# EAGLE design dashbutton_v1 (EAGLE 9.3.0)
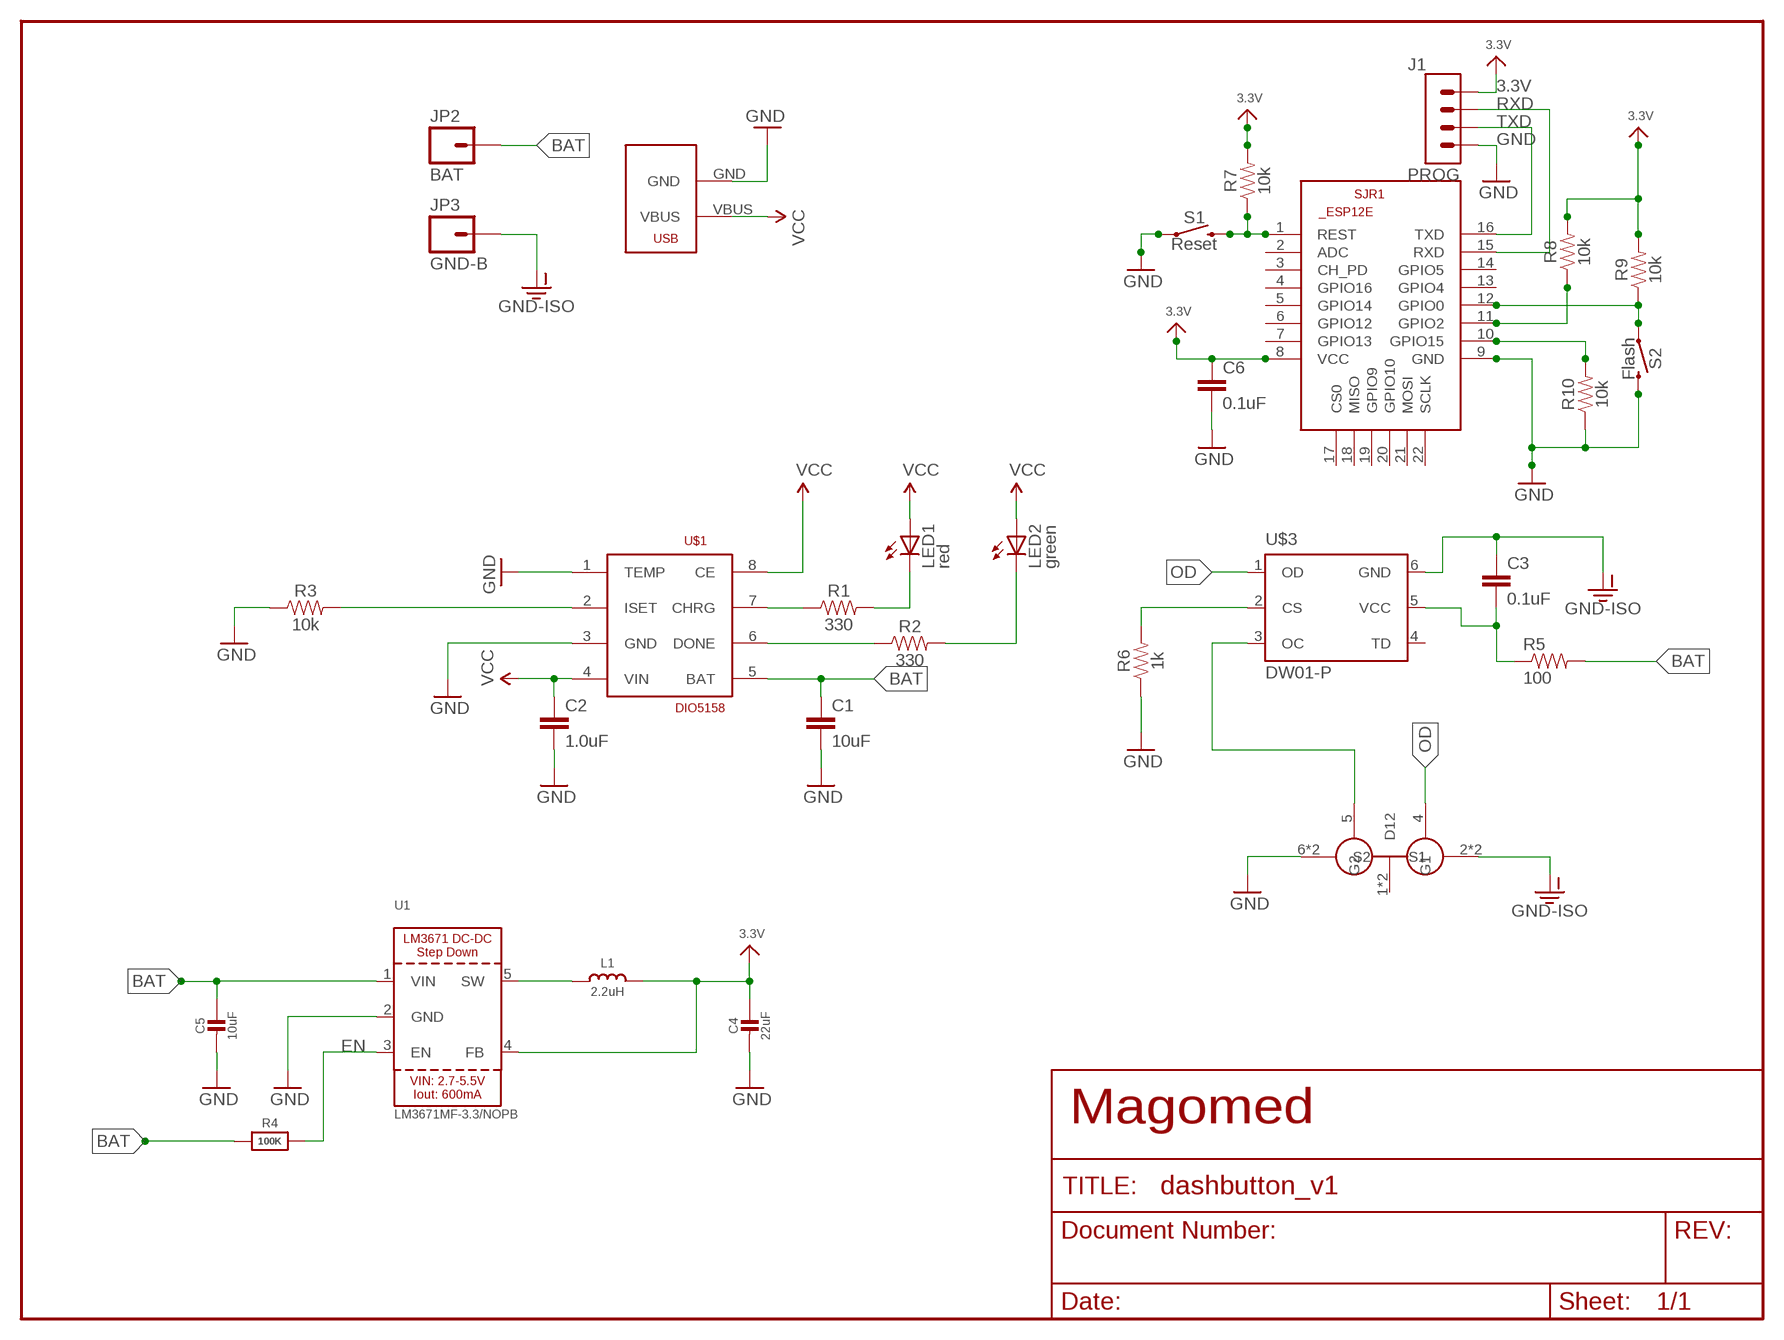
[diagram p0: schematic, sheet 1]

## Parts
C1  10uF  10UF-1206-6.3V-20%  [1206]
C2  1.0uF  1.0UF-0603-16V-10%  [0603]
C3  0.1uF  0.1UF-0603-25V-5%  [0603]
C4  22uF  CAP_CERAMIC0805-NOOUTLINE  [0805-NO]
C5  10uF  CAP_CERAMIC0805-NOOUTLINE  [0805-NO]
C6  0.1uF  0.1UF-0603-25V-5%  [0603]
J1  PROG  62000411121  [62000411121]
JP2  BAT  M01PTH  [1X01]
JP3  GND-B  M01PTH  [1X01]
L1  2.2uH  INDUCTORNRH2412T  [INDUCTOR_TAIYOYUDEN_NRH2412T]
LED1  red  LEDCHIP-LED0805  [CHIP-LED0805]
LED2  green  LEDCHIP-LED0805  [CHIP-LED0805]
R1  330  330OHM-0603-1/10W-1%  [0603]
R2  330  330OHM-0603-1/10W-1%  [0603]
R3  10k  2.49KOHM-0603-1/10W-1%  [0603]
R4  100K  RESISTOR0805_NOOUTLINE  [0805-NO]
R5  100  RESISTOR0603-RES  [0603-RES]
R6  1k  1KOHM-0603-1/10W-1%  [0603]
R7  10k  10KOHM-0603-1/10W-1%  [0603]
R8  10k  10KOHM-0603-1/10W-1%  [0603]
R9  10k  10KOHM-0603-1/10W-1%  [0603]
R10  10k  10KOHM-0603-1/10W-1%  [0603]
S1  Reset  MOMENTARY-SWITCH-SPST-SMD-6.2MM-TALL  [TACTILE_SWITCH_SMD_6.2MM_TALL]
S2  Flash  MOMENTARY-SWITCH-SPST-SMD-6.2MM-TALL  [TACTILE_SWITCH_SMD_6.2MM_TALL]
SJR1  ESP8266-12EESP12E  [ESP8266-ESP12E]
U1  LM3671MF-3.3/NOPB  VREG_LM3671  [SOT23-5]
U$1  DIO5158  [SOIC-8]
U$3  DW01-P  [SOT23-6L]
U$4  FS8205A  [TSSOP8]
U$5  USB-MICROB-POWERONLY  [USB-MICROB-POWERONLY]

## Nets
3.3V: C4.1 C6.1 J1.1 L1.2 R7.2 R8.2 R9.2 SJR1.8(VCC) U1.4(FB)
BAT: C1.1 C5.1 JP2.1 R4.1 R5.2 U1.1(VIN) U$1.5(BAT)
CHRG: R1.1 U$1.7(CHRG)
DONE: R2.1 U$1.6(DONE)
EN: R4.2 U1.3(EN)
GND: C1.2 C2.2 C4.2 C5.2 C6.2 J1.4 R3.1 R6.1 R10.1 S1.A2 S2.B2 SJR1.9(GND) U1.2(GND) U$1.1(TEMP) U$1.3(GND) U$4.6(S2) U$4.7(S2) U$5.GND
GND-ISO: C3.1 JP3.1 U$3.6(GND) U$4.2(S1) U$4.3(S1)
ISET: R3.2 U$1.2(ISET)
LED1: LED1.C R1.2
LED2: LED2.C R2.2
N$1: R6.2 U$3.2(CS)
N$2: U$3.3(OC) U$4.5(G2)
N$3: L1.1 U1.5(SW)
N$4: R7.1 S1.B2 SJR1.1(REST)
N$5: R9.1 S2.A2 SJR1.12(GPIO0)
N$6: R10.2 SJR1.10(GPIO15)
N$7: R8.1 SJR1.11(GPIO2)
OD: U$3.1(OD) U$4.4(G1)
RXD: J1.2 SJR1.15(RXD)
TXD: J1.3 SJR1.16(TXD)
VCC: C2.1 LED1.A LED2.A U$1.4(VIN) U$1.8(CE) U$5.VBUS
VCC-DW: C3.2 R5.1 U$3.5(VCC)
Unconnected: SJR1.2(ADC) SJR1.3(CH_PD) SJR1.4(GPIO16) SJR1.5(GPIO14) SJR1.6(GPIO12) SJR1.7(GPIO13) SJR1.13(GPIO4) SJR1.14(GPIO5) SJR1.17(CS0) SJR1.18(MISO) SJR1.19(GPIO9) SJR1.20(GPIO10) SJR1.21(MOSI) SJR1.22(SCLK) U$3.4(TD) U$4.1(D12) U$4.8(D12)

## Notes on the sheet
- Magomed

## Library data of the parts
C1 = SparkFun-Capacitors:10UF: 10.0µF ceramic capacitors A capacitor is a passive two-terminal electrical component used to store electrical energy temporarily in an electric field.; PROD_ID: CAP-10057
C2 = SparkFun-Capacitors:1.0UF: 1µF ceramic capacitors A capacitor is a passive two-terminal electrical component used to store electrical energy temporarily in an electric field.; PROD_ID: CAP-00868
C3 C6 = SparkFun-Capacitors:0.1UF: 0.1µF ceramic capacitors A capacitor is a passive two-terminal electrical component used to store electrical energy temporarily in an electric field.; PROD_ID: CAP-08604
C4 C5 = microbuilder:CAP_CERAMIC: Ceramic Capacitors For new designs, use the packages preceded by an '_' character since they are more reliable: The following footprints should be used on most boards: _0402 - Standard footprint for regular board layouts _0603 - Standard footprint for regular board layouts _0805 - Standard footprint for regular board layouts _1206 - Standard footprint for regular board layouts For extremely tight-pitch boards where space is at a premium, the following 'micro-pitch' footprints can be used (smaller pads, no silkscreen outline, etc.): _0402MP - Micro-pitch footprint for very dense/compact boards _0603MP - Micro-pitch footprint for very dense/compact boards _0805MP - Micro-pitch footprint for very dense/compact boards _1206MP - Micro-pitch footprint for very dense/compact boards
J1 = Headers:62000411121: THT Vertical Pin Header WR-PHD, Pitch 2.00 mm, Single Row, 4 pins Manufacturer's datasheet <https://datasheet.octopart.com/62000411121-W%C3%BCrth-Elektronik-datasheet-117282003.pdf>; CREATED_BY: PCBLayout.com; MANUFACTURER: Würth Elektronik; MPN: 62000411121
JP2 JP3 = SparkFun:M01: Header 1 Standard 1-pin 0.1" header. Use with straight break away headers (SKU : PRT-00116), right angle break away headers (PRT-00553), swiss pins (PRT-00743), machine pins (PRT-00117), and female headers (PRT-00115).
L1 = microbuilder:INDUCTOR: Inductors 0603: 10nH Ceramic Inductor - microwire antenna/RF (Digikey: 712-1434-2-ND) 0805: 560nH Ceramic Inductor - RF (Digikey: 553-1047-1-ND) 270nH Ceramic Inductor - Q = 40@250MHz, +-5%, 1 Ohm DC Resistance (Digikey: 535-10506-2-ND) 1007 (2518 Metric) SMT: 10µH 10% 250mOhm 820mA 1007 Inductor (Digikey: 587-2189-1-ND) 22µH 10% 500mOhm 580mA 1007 Inductor (Digikey: 587-2190-1-ND) 47µH 10% 950mOhm 420mA 1007 Inductor (Digikey: 587-2191-1-ND) 47µH 5% 100mOhm 1A 1008 Inductor (Digikey: 732-1816-1-ND) 5.0x5.0mm (Taiyo Yuden NR5040 Series) 6.8µH 20% 2.3A 64mOhm Inductor (Digikey: 587-2374-2-ND) 5.0x5.0mm (TDK VLC5045 Series) 4.7µH 20% 3.3A 34mOhm Inductor (Digikey: 445-6526-1-ND) 6.8µH 20% 2.7A 46mOhm Inductor (Digikey: 445-6527-1-ND) 6.0x6.0mm (TDK VLC6045 Series) 4.7µH 20% 3.8A 27mOhm Inductor (Digikey: 445-6538-2-ND) 6.8µH 20% 3A 41mOhm Inductor (Digikey: 445-6540-1-ND) 6.2µH 30% 2.2A 45mOhm Inductor (Digikey: SRR5028-6R2YCT-ND) - Not TDK VLC6045 but footprint should match 6.0x6.0mm (TDK SLF6045 Series) 6.8uH 30% 2A 33mOhm Inductor (Digikey: 445-4572-1-ND, Mouser: 810-SLF645T6R8N2R0PF) 6.0x6.0mm (Sumida CDRH5D28 Series) 6.2uH 30% 1.8A 45mOhm Inductor (Digikey: 308-1542-1-ND) Taiyo Yuden NR3015T2R2M - 2.2uH 20% 1.5A (Digikey: 587-1648-2-ND, Mouser: 963-NR3015T2R2M) - Used with TI TPS62172 CoilCraft RFID Transponder Coil - MA5532-AE (For use with AS3935 Lightning Sensor) Taiyo Yuden NRH2412T2R2MNGH - 2.2uH 20% 1AA (Digikey: 587-3443-1-ND) - Used with TI LM3671 Vishay IHLP 1.0uH Molded Inductor - 24mOhm DCR, 5A, +/-20%, -55°C-125°C (Digikey: 541-1319-1-ND)
LED1 LED2 = adafruit:LED: LED OSRAM: - CHIPLED LG R971, LG N971, LY N971, LG Q971, LY Q971, LO R971, LY R971 LH N974, LH R974 LS Q976, LO Q976, LY Q976 LO Q996 - Hyper CHIPLED LW Q18S LB Q993, LB Q99A, LB R99A - SideLED LS A670, LO A670, LY A670, LG A670, LP A670 LB A673, LV A673, LT A673, LW A673 LH A674 LY A675 LS A676, LA A676, LO A676, LY A676, LW A676 LS A679, LY A679, LG A679 - Hyper Micro SIDELED® LS Y876, LA Y876, LO Y876, LY Y876 LT Y87S - SmartLED LW L88C, LW L88S LB L89C, LB L89S, LG L890 LS L89K, LO L89K, LY L89K LS L896, LA L896, LO L896, LY L896 - TOPLED LS T670, LO T670, LY T670, LG T670, LP T670 LSG T670, LSP T670, LSY T670, LOP T670, LYG T670 LG T671, LOG T671, LSG T671 LB T673, LV T673, LT T673, LW T673 LH T674 LS T676, LA T676, LO T676, LY T676, LB T676, LH T676, LSB T676, LW T676 LB T67C, LV T67C, LT T67C, LS T67K, LO T67K, LY T67K, LW E67C LS E67B, LA E67B, LO E67B, LY E67B, LB E67C, LV E67C, LT E67C LW T67C LS T679, LY T679, LG T679 LS T770, LO T770, LY T770, LG T770, LP T770 LB T773, LV T773, LT T773, LW T773 LH T774 LS E675, LA E675, LY E675, LS T675 LS T776, LA T776, LO T776, LY T776, LB T776 LHGB T686 LT T68C, LB T68C - Hyper Mini TOPLED® LB M676 - Mini TOPLED Santana® LG M470 LS M47K, LO M47K, LY M47K Source: http://www.osram.convergy.de/
R1 R2 = SparkFun-Resistors:330OHM: 330Ω resistor A resistor is a passive two-terminal electrical component that implements electrical resistance as a circuit element. Resistors act to reduce current flow, and, at the same time, act to lower voltage levels within circuits. - Wikipedia; PROD_ID: RES-00818
R3 = SparkFun-Resistors:2.49KOHM: 2.49kΩ resistor A resistor is a passive two-terminal electrical component that implements electrical resistance as a circuit element. Resistors act to reduce current flow, and, at the same time, act to lower voltage levels within circuits. - Wikipedia; PROD_ID: RES-09568; VALUE: 2.49k
R4 = microbuilder:RESISTOR: Resistors For new designs, use the packages preceded by an '_' character since they are more reliable: The following footprints should be used on most boards: _0402 - Standard footprint for regular board layouts _0603 - Standard footprint for regular board layouts _0805 - Standard footprint for regular board layouts _1206 - Standard footprint for regular board layouts For extremely tight-pitch boards where space is at a premium, the following 'micro-pitch' footprints can be used (smaller pads, no silkscreen outline, etc.): _0402MP - Micro-pitch footprint for very dense/compact boards _0603MP - Micro-pitch footprint for very dense/compact boards _0805MP - Micro-pitch footprint for very dense/compact boards _1206MP - Micro-pitch footprint for very dense/compact boards
R5 = SparkFun:RESISTOR: Resistor Basic schematic elements and footprints for 0603, 1206, and PTH resistors.
R6 = SparkFun-Resistors:1KOHM: 1kΩ resistor A resistor is a passive two-terminal electrical component that implements electrical resistance as a circuit element. Resistors act to reduce current flow, and, at the same time, act to lower voltage levels within circuits. - Wikipedia; PROD_ID: RES-07856
R7-R10 = SparkFun-Resistors:10KOHM: 10kΩ resistor A resistor is a passive two-terminal electrical component that implements electrical resistance as a circuit element. Resistors act to reduce current flow, and, at the same time, act to lower voltage levels within circuits. - Wikipedia; PROD_ID: RES-00824
S1 S2 = SparkFun-Switches:MOMENTARY-SWITCH-SPST: Momentary Switch (Pushbutton) - SPST Normally-open (NO) SPST momentary switches (buttons, pushbuttons). Variants PTH-12MM - 12mm square, through-hole Momentary Pushbutton Switch - 12mm Square <https://www.sparkfun.com/products/9190> (COM-09190) PTH-6.0MM, PTH-6.0MM-KIT - 6.0mm square, through-hole Mini Pushbutton Switch <https://www.sparkfun.com/products/97> (COM-00097) KIT package intended for soldering kit's - only one side of pads' copper is exposed. PTH-RIGHT-ANGLE-KIT - Right-angle, through-hole Right Angle Tactile Button <https://www.sparkfun.com/products/10791> - Used on SparkFun BigTime Watch Kit <https://www.sparkfun.com/products/11734> SMD-12MM - 12mm square, surface-mount Tactile Button - SMD (12mm) <https://www.sparkfun.com/products/12993> (COM-12993) Used on SparkFun PicoBoard <https://www.sparkfun.com/products/11888> SMD-4.5MM - 4.5mm Square Trackball Switch Used on SparkFun Blackberry Trackballer Breakout <https://www.sparkfun.com/products/13169> SMD-4.6MMX2.8MM - 4.60mm x 2.80mm, surface mount Used on SparkFun SAMD21 Mini Breakout <https://www.sparkfun.com/products/13664> SMD-5.2MM, SMD-5.2-REDUNDANT - 5.2mm square, surface-mount Mini Pushbutton Switch - SMD <https://www.sparkfun.com/products/8720> (COM-08720) Used on Arduino Pro Mini <https://www.sparkfun.com/products/11114> REDUNDANT package connects both switch circuits together SMD-6.0X3.5MM - 6.0 x 3.5mm, surface mount Momentary Reset Switch SMD <https://www.sparkfun.com/products/8229> (COM-08229) SMD-6.2MM-TALL - 6.2mm square, surface mount Tactile Button - SMD (6mm) <https://www.sparkfun.com/products/12992> Used on SparkFun Digital Sandbox <https://www.sparkfun.com/products/12651> SMD-RIGHT-ANGLE - Right-angle, surface mount Used on SparkFun Block for Intel® Edison - Arduino <https://www.sparkfun.com/products/13036>; PROD_ID: SWCH-11966; SF_SKU: COM-12992
SJR1 = esp12e:ESP8266-12E: ESP8266-12E Library for Eagle CAD The author not responsible for any damages or errors!. Created by Suhail jr.lt;/author>
U1 = microbuilder:VREG_LM3671: LM3671 - 600mA DC-DC Step-Down Converter VIN: 2.7-5.5V Load Current: 600mA Switching Frequency: 2MHz Iq: 16uA
U$1 = ERADIONICA:DIO5158
U$3 = lipo:DW01-P: One Cell Lithium-ion/Polymer Battery Protection IC The DW01-P battery protection IC is designed to protect lithium-ion/polymer battery from damage or degrading the lifetime due to overcharge, overdischarge, and/or overcurrent for one-cell lithium-ion/polymer battery powered systems, such as cellular phones. The ultra-small package and less required external components make it ideal to integrate the DW01-P into the limited space of battery pack. The accurate ±50mV overcharging detection voltage ensures safe and full utilization charging. The very low standby current drains little current from the cell while in storage.
U$4 = SparkFun:FS8205A
U$5 = ERADIONICA:USB-MICROB-POWERONLY

## Board
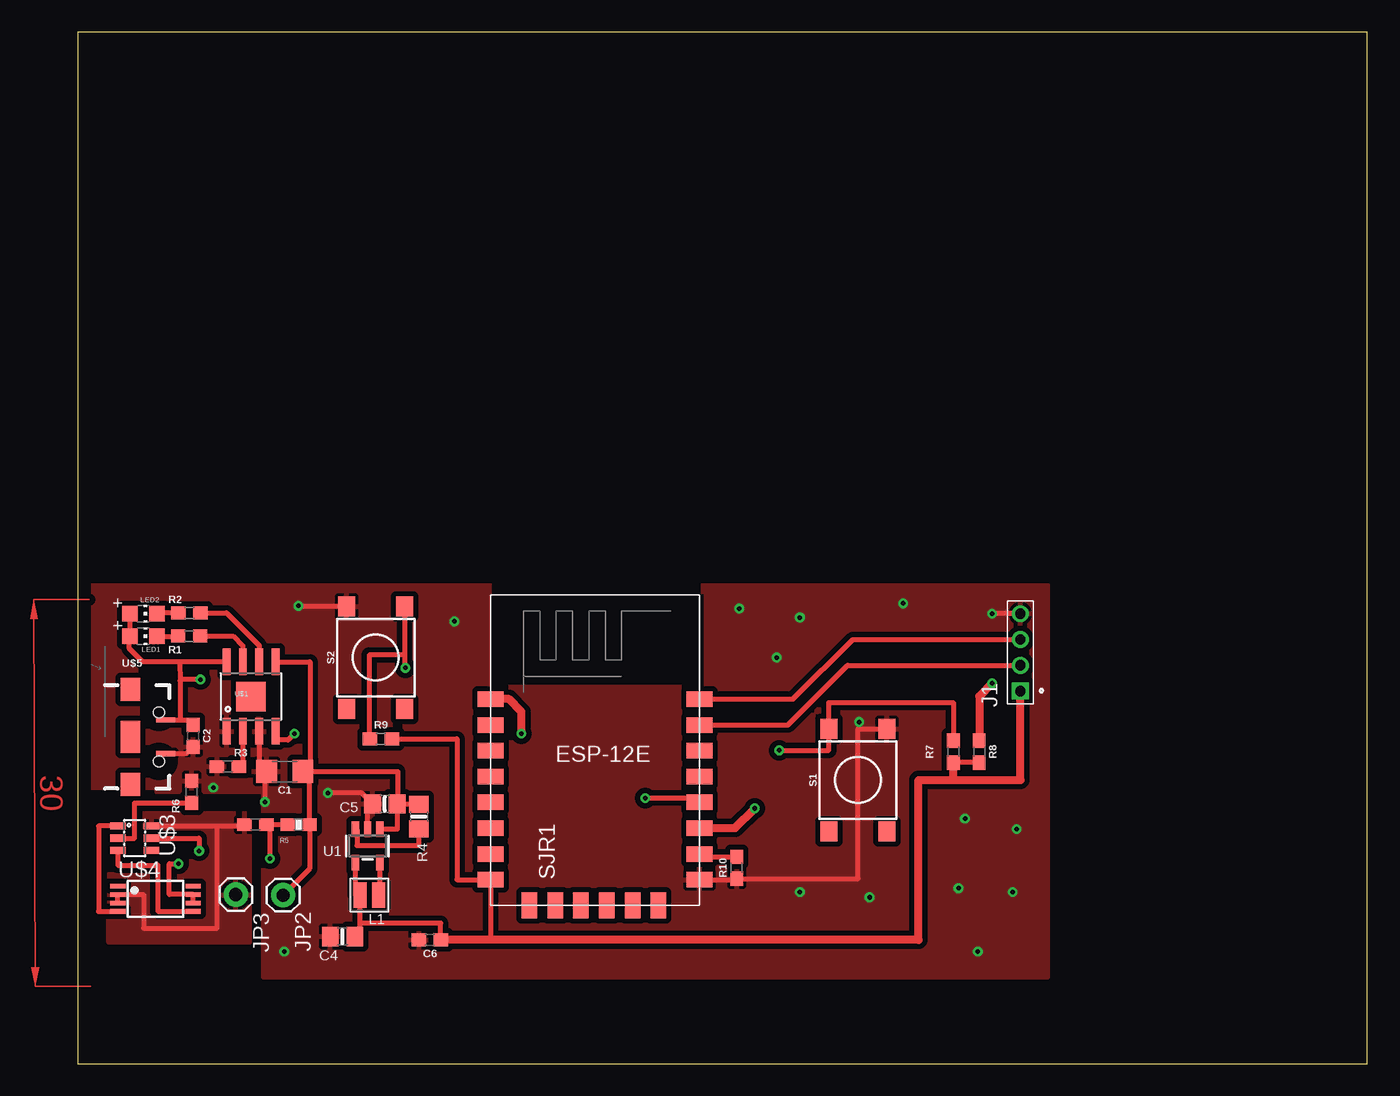
[diagram p1: board, top side]
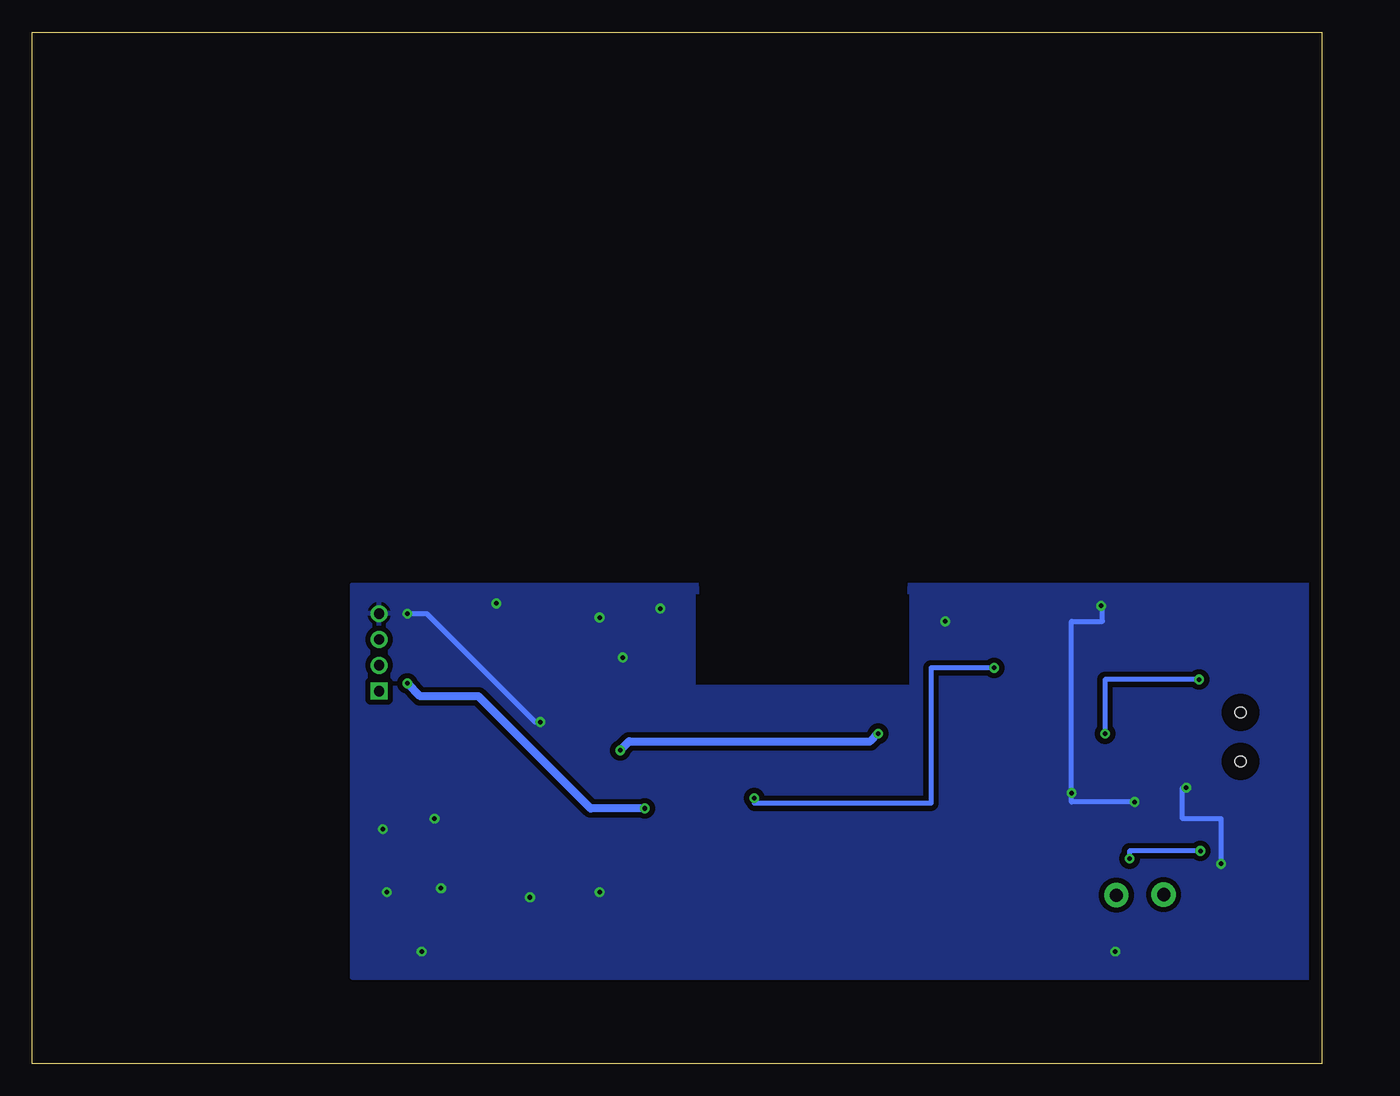
[diagram p2: board, bottom side, seen from below]

Size 100 x 80 mm. Coordinates in mm from the lower left corner, seen from the top.
Outline: 0,0 100,0 100,80 0,80 0,0
Copper layers (1*16): Top 0.035mm / dielectric 1.5mm / Bottom 0.035mm
Design rules "default *": minimum track width 6mil, minimum drill 0.35mm, track to track 16mil, track to pad 10mil, pad to pad 10mil, via to via 6mil, smd to smd 6mil, copper to edge 40mil, drill to drill 6mil, minimum pad ring 10mil, minimum via ring 8mil, stop-mask expansion 4mil, vias tented up to drill 0mil, thermal gap 10mil

### Footprints (pad centres in the part's own frame; a part is rotated, then mirrored left to right if it is on the bottom)
1206 = smd 1.6 x 1.8: 1 -1.4,0; 2 1.4,0
0603 = smd 1.1 x 1: 1 -0.85,0; 2 0.85,0
0805-NO = smd 1.3 x 1.5: 1 -0.95,0; 2 0.95,0
62000411121 = drill 0.8 square: 1 -3,0 | drill 0.8: 2 -1,0; 3 1,0; 4 3,0
1X01 = drill 1.016 pad 1.88: 1 0,0
INDUCTOR_TAIYOYUDEN_NRH2412T = smd 1 x 2: 1 -0.725,0; 2 0.725,0
CHIP-LED0805 = smd 1.2 x 1.2: A 0,-1.05; C 0,1.05
0603-RES = smd 1.1 x 1: 1 -0.85,0; 2 0.85,0
TACTILE_SWITCH_SMD_6.2MM_TALL = smd 1.55 x 1.3: A1 -3.975,-2.25; A2 3.975,-2.25; B1 -3.975,2.25; B2 3.975,2.25
ESP8266-ESP12E = smd 2 x 1.2: 1 -7.62,5.84; 2 -7.62,3.84; 3 -7.62,1.84; 4 -7.62,-0.16; 5 -7.62,-2.16; 6 -7.62,-4.16; 7 -7.62,-6.16; 8 -7.62,-8.16; 9 8.58,-8.16; 10 8.58,-6.16; 11 8.58,-4.16; 12 8.58,-2.16; 13 8.58,-0.16; 14 8.58,1.84; 15 8.58,3.84; 16 8.58,5.84 | smd 1.2 x 2: 17 -4.62,-10.16; 18 -2.62,-10.16; 19 -0.62,-10.16; 20 1.38,-10.16; 21 3.38,-10.16; 22 5.38,-10.16
SOT23-5 = smd 0.55 x 1.2: 1 -0.95,-1.3; 2 0,-1.3; 3 0.95,-1.3; 4 0.95,1.3; 5 -0.95,1.3
SOIC-8 = smd 0.61 x 2.057: 1 -2.07,-2.892; 2 -0.8,-2.892; 3 0.47,-2.892; 4 1.74,-2.892; 5 1.74,2.492; 6 0.47,2.492; 7 -0.8,2.492; 8 -2.07,2.492 | smd 2.286 x 2.286: EPAD -0.165,-0.2
SOT23-6L = smd 0.55 x 1.2: 1 -0.95,-1.3; 2 0,-1.3; 3 0.95,-1.3; 4 0.95,1.3; 5 0,1.3; 6 -0.95,1.3
TSSOP8 = smd 1.2 x 0.35: 1 -2.925,0.975; 2 -2.925,0.325; 3 -2.925,-0.325; 4 -2.925,-0.975; 5 2.925,-0.975; 6 2.925,-0.325; 7 2.925,0.325; 8 2.925,0.975
USB-MICROB-POWERONLY = smd 1.45 x 0.4: GND 1.455,-1.3; VBUS 1.455,1.3 | smd 1.5 x 1.8: SHIELD1 -1.27,3.685; SHIELD2 -1.27,-3.685 | smd 1.5 x 2.5: SHIELD3 -1.27,0 | hole 0.85: 0.93,1.9; 0.93,-1.9

### Placement (x,y rotation side)
C1  16.04,22.66 180 top
C2  8.94,25.42 270 top
C3  13.77,18.54 0 top
C4  20.53,9.86 180 top
C5  23.81,20.15 180 top
C6  27.3,9.6 180 top
J1  73.1,31.9 90 top
JP2  15.92,13.07 0 top
JP3  12.25,13.11 0 top
L1  22.61,13.08 180 top
LED1  5.09,33.15 270 top
LED2  5.09,34.9 270 top
R1  8.64,33.16 180 top
R2  8.65,34.96 180 top
R3  11.64,23.04 0 top
R4  26.45,19.16 270 top
R5  17.12,18.54 0 top
R6  8.84,21.07 270 top
R7  67.9,24.2 270 top
R8  69.9,24.2 270 top
R9  23.5,25.2 0 top
R10  51.1,15.2 90 top
S1  60.5,22 90 top
S2  23.1,31.5 90 top
SJR1  39.64,22.43 0 top
U1  22.47,16.88 180 top
U$1  13.6,28.68 0 top
U$3  4.41,17.49 270 top
U$4  6.02,12.79 0 top
U$5  5.36,25.35 0 top

### Tracks (layer width: path | path; a pad name or v marks a point on that pad's centre or on a via)
3.3V
  Top 0.406: U1.4 21.52,13.08 L1.2 21.89,10.9 | C4.1 21.89,9.86 21.89,10.9 | 21.89,10.9 28.15,10.9 C6.1 28.25,9.7 32.02,9.7 SJR1.8 29.4,14.27 29.4,25.2 R9.2 | R8.2 R7.2
  Top 0.61: 67.9,22 R7.2 | C6.1 65.2,9.6 65.2,22 67.9,22 | J1.1 73.1,22 67.9,22
BAT
  Top 0.406: U$1.5 18,31.17 18,22.66 17.97,22.66 | 17.97,22.66 C1.1 24.8,22.66 24.8,20.15 C5.1 | 17.97,22.66 R5.2 17.97,15.12 JP2.1 | C5.1 24.7,20.15 | R4.1 24.76,20.11 C5.1 | C5.1 24.76,18.18 U1.1
CHRG
  Top 0.406: R1.1 12.04,33.16 12.8,32.4 U$1.7
DONE
  Top 0.406: R2.1 11.54,34.96 14.07,32.43 U$1.6
EN
  Top 0.406: U1.3 21.66,18.18 21.66,16.92 26.45,16.92 R4.2
GND  (via drill 0.35)
  Top 0.406: U$5.GND 8.42,24.05 C2.2 | U$1.3 14.07,22.66 C1.2 14.5,22.52 v14.5,20.3 | U$4.6 U$4.7 7.1,13.12 7.1,15.5 v7.8,15.5 | U1.2 22.47,20.15 C5.2 | 22.86,20.5 C5.2 | C5.2 22.01,21 v19.4,21 | SJR1.9 51.1,14.27 R10.1 60.5,14.35 60.5,25.98 S1.A2 | v17.1,35.5 20.85,35.5 S2.B2 | J1.4 v70.9,34.9 | v60.6,26.5 60.5,26.5
  Bottom 0.406: v7.8,15.5 7.8,19 10.8,19 10.8,21.4 v10.5,21.4 | v14.5,20.3 19.4,20.3 v19.4,21 19.4,34.3 17,34.3 17,35.5 v17.1,35.5 | v70.9,34.9 69.4,34.9 61,26.5 v60.6,26.5
  other vias: 72.8,18.2 68.8,19 68.3,13.6 72.5,13.3 69.8,8.7 61.4,12.9 56,13.3 54.2,31.5 56,34.6 64,35.7 51.3,35.3 16,8.7 29.2,34.3
  pour Top: 6.1,25 6.1,21.1 15.4,21.1 15.4,23.8 14.3,23.8 11.9,23.8 11.9,26.7 10.7,26.7 10.7,25 10.1,25
  pour Top: 28,23.7 19,23.7 19,8.8 28,8.8
  pour Bottom: 0.2,37.1 75.2,37.1 75.2,6.7 0.2,6.7
  pour Top: 0.2,37.1 75.2,37.1 75.2,6.7 14.4,6.7 14.4,21.4 0.2,21.4
GND-ISO
  Top 0.406: U$3.6 10.8,18.44 | 10.8,18.44 12.92,18.44 C3.1 | U$4.3 U$4.2 5.1,13.12 5.1,10.5 10.8,10.5 10.8,18.44
  pour Top: 5,19.4 13.3,19.4 13.3,9.4 2.4,9.4 2.4,14.7 4.9,14.7 4.9,19.4
ISET
  Top 0.406: U$1.2 12.8,23.04 R3.2
LED1
  Top 0.406: LED1.C R1.2
LED2
  Top 0.406: R2.2 6.2,34.96 LED2.C
N$1
  Top 0.406: U$3.2 4.4,17.49 4.4,20.22 R6.2
N$2
  Top 0.406: U$3.3 3.11,15.4 6.2,15.4 6.2,11.81 U$4.5
N$3
  Top 0.406: U1.5 23.42,13.08 L1.1
N$4  (via drill 0.35)
  Top 0.406: v54.4,24.3 58.25,24.3 S1.B2 58.25,28 67.9,28 R7.1
  Top 0.61: S1.B2 58.25,25.88 | v34.4,25.6 34.4,27.3 33.43,28.27 SJR1.1
  Bottom 0.61: v54.4,24.3 53.7,25 35,25 v34.4,25.6
N$5  (via drill 0.35)
  Top 0.406: S2.A2 25.35,31.7 | 25.35,31.7 22.6,31.7 22.6,25.2 R9.1 | 25.35,31.7 25.35,30.7 v25.4,30.7 | v44,20.6 48.22,20.6 SJR1.12
  Bottom 0.406: v25.4,30.7 30.3,30.7 30.3,20.2 44,20.2 v44,20.6
N$6
  Top 0.406: SJR1.10 48.22,16.05 R10.2
N$7  (via drill 0.35)
  Top 0.61: v52.5,19.8 50.97,18.27 SJR1.11 | v70.9,29.5 69.9,28.5 R8.1
  Bottom 0.61: v52.5,19.8 56.7,19.8 65.4,28.5 69.9,28.5 v70.9,29.5
NA
  cutout Top: 32.3,37.1 48.1,37.1 48.1,30.3 32.3,30.3
  cutout Bottom: 32.3,37.1 48.1,37.1 48.1,30.3 32.3,30.3
OD
  Top 0.406: U$3.1 1.6,18.44 1.6,11.81 | 1.6,11.8 1.6,11.81 | 1.6,11.81 U$4.4
RXD
  Top 0.406: SJR1.15 55.07,26.27 59.7,30.9 J1.2
TXD
  Top 0.406: SJR1.16 55.47,28.27 60.1,32.9 J1.3
VCC  (via drill 0.35)
  Top 0.152: 4.01,34.88 LED2.A
  Top 0.406: 7.94,31.17 U$1.8 7.9,31.17 | LED2.A LED1.A 4,33.11 4,32.2 5.03,31.17 7.9,31.17 | v16.8,25.6 16.3,25.1 15.34,25.1 U$1.4 | U$5.VBUS 7.93,26.65 | 7.93,26.65 8.56,26.65 C2.1 | 7.94,29.7 7.93,29.69 | 7.93,29.69 7.93,26.65 | 7.9,31.17 7.93,29.69 | v9.5,29.8 8.04,29.8 arc90 7.93,29.69
  Bottom 0.406: v9.5,29.8 16.8,29.8 v16.8,25.6
VCC-DW  (via drill 0.35)
  Top 0.406: U$3.5 9.4,17.49 v9.4,16.5 | v14.9,15.9 14.9,18.54 C3.2 R5.1
  Bottom 0.406: v9.4,16.5 14.9,16.5 v14.9,15.9
(copper drawn outside any net)
  shapes: Top area x1